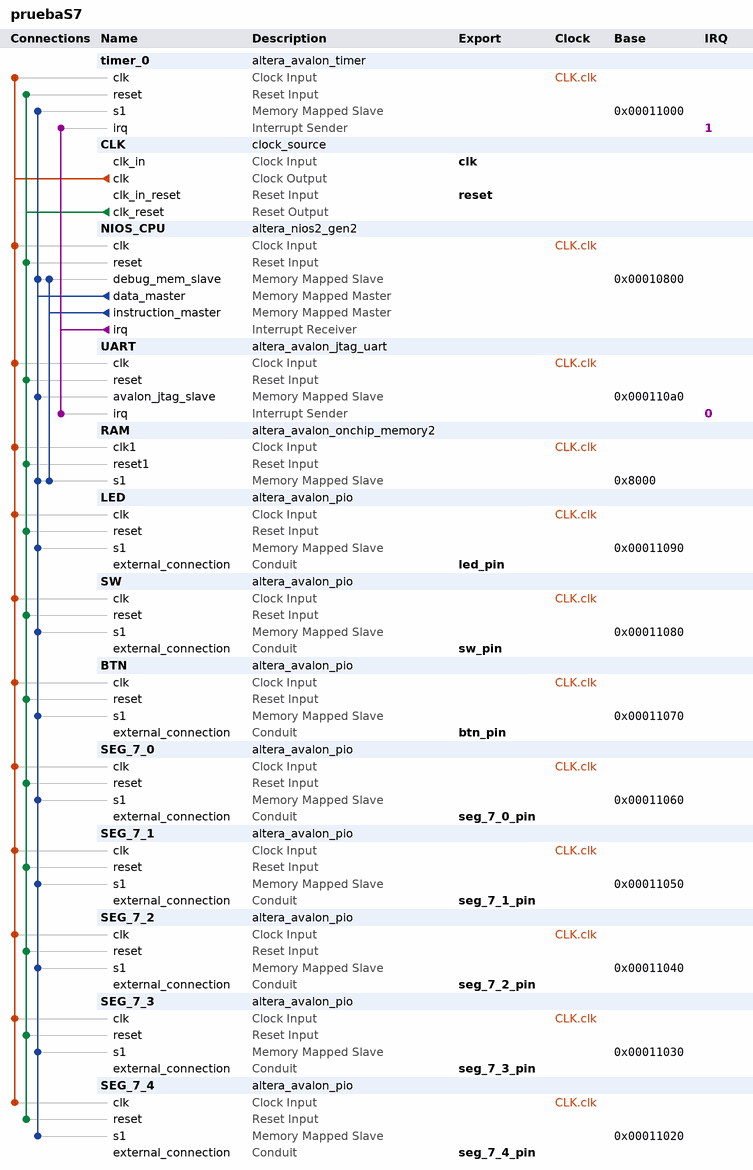
[diagram p0: system contents]
# Platform Designer (Qsys) system pruebaS7, Cyclone V 5CSEMA5F31C6
# Parameters at their usual value, and those the tool derives, are not listed.
package require -exact qsys 18.1
create_system pruebaS7
set_project_property DEVICE_FAMILY {Cyclone V}
set_project_property DEVICE 5CSEMA5F31C6

add_instance timer_0 altera_avalon_timer 18.1
set_instance_parameter_value timer_0 alwaysRun true
set_instance_parameter_value timer_0 fixedPeriod true
set_instance_parameter_value timer_0 period 1
set_instance_parameter_value timer_0 periodUnits SEC
set_instance_parameter_value timer_0 snapshot false

add_instance CLK clock_source 18.1
set_instance_parameter_value CLK clockFrequency 50000000

add_instance NIOS_CPU altera_nios2_gen2 18.1
set_instance_parameter_value NIOS_CPU dcache_size 2048
set_instance_parameter_value NIOS_CPU exceptionSlave RAM.s1
set_instance_parameter_value NIOS_CPU icache_size 4096
set_instance_parameter_value NIOS_CPU impl Tiny
set_instance_parameter_value NIOS_CPU resetSlave RAM.s1

add_instance UART altera_avalon_jtag_uart 18.1
set_instance_parameter_value UART simInteractiveOptions NO_INTERACTIVE_WINDOWS

add_instance RAM altera_avalon_onchip_memory2 18.1
set_instance_parameter_value RAM dataWidth 32
set_instance_parameter_value RAM dualPort false
set_instance_parameter_value RAM initMemContent true
set_instance_parameter_value RAM initializationFileName onchip_mem.hex
set_instance_parameter_value RAM memorySize 32768

add_instance LED altera_avalon_pio 18.1
set_instance_parameter_value LED direction Output
set_instance_parameter_value LED width 8

add_instance SW altera_avalon_pio 18.1
set_instance_parameter_value SW direction Input
set_instance_parameter_value SW width 8

add_instance BTN altera_avalon_pio 18.1
set_instance_parameter_value BTN direction Input
set_instance_parameter_value BTN width 2

add_instance SEG_7_0 altera_avalon_pio 18.1
set_instance_parameter_value SEG_7_0 direction Output
set_instance_parameter_value SEG_7_0 width 7

add_instance SEG_7_1 altera_avalon_pio 18.1
set_instance_parameter_value SEG_7_1 direction Output
set_instance_parameter_value SEG_7_1 width 7

add_instance SEG_7_2 altera_avalon_pio 18.1
set_instance_parameter_value SEG_7_2 direction Output
set_instance_parameter_value SEG_7_2 width 7

add_instance SEG_7_3 altera_avalon_pio 18.1
set_instance_parameter_value SEG_7_3 direction Output
set_instance_parameter_value SEG_7_3 width 7

add_instance SEG_7_4 altera_avalon_pio 18.1
set_instance_parameter_value SEG_7_4 direction Output
set_instance_parameter_value SEG_7_4 width 7

# connections
add_connection CLK.clk BTN.clk clock
add_connection CLK.clk LED.clk clock
add_connection CLK.clk NIOS_CPU.clk clock
add_connection CLK.clk RAM.clk1 clock
add_connection CLK.clk SEG_7_0.clk clock
add_connection CLK.clk SEG_7_1.clk clock
add_connection CLK.clk SEG_7_2.clk clock
add_connection CLK.clk SEG_7_3.clk clock
add_connection CLK.clk SEG_7_4.clk clock
add_connection CLK.clk SW.clk clock
add_connection CLK.clk timer_0.clk clock
add_connection CLK.clk UART.clk clock
add_connection CLK.clk_reset BTN.reset reset
add_connection CLK.clk_reset LED.reset reset
add_connection CLK.clk_reset NIOS_CPU.reset reset
add_connection CLK.clk_reset RAM.reset1 reset
add_connection CLK.clk_reset SEG_7_0.reset reset
add_connection CLK.clk_reset SEG_7_1.reset reset
add_connection CLK.clk_reset SEG_7_2.reset reset
add_connection CLK.clk_reset SEG_7_3.reset reset
add_connection CLK.clk_reset SEG_7_4.reset reset
add_connection CLK.clk_reset SW.reset reset
add_connection CLK.clk_reset timer_0.reset reset
add_connection CLK.clk_reset UART.reset reset
add_connection NIOS_CPU.data_master BTN.s1 avalon
set_connection_parameter_value NIOS_CPU.data_master/BTN.s1 baseAddress 0x00011070
add_connection NIOS_CPU.data_master LED.s1 avalon
set_connection_parameter_value NIOS_CPU.data_master/LED.s1 baseAddress 0x00011090
add_connection NIOS_CPU.data_master NIOS_CPU.debug_mem_slave avalon
set_connection_parameter_value NIOS_CPU.data_master/NIOS_CPU.debug_mem_slave baseAddress 0x00010800
add_connection NIOS_CPU.data_master RAM.s1 avalon
set_connection_parameter_value NIOS_CPU.data_master/RAM.s1 baseAddress 0x8000
add_connection NIOS_CPU.data_master SEG_7_0.s1 avalon
set_connection_parameter_value NIOS_CPU.data_master/SEG_7_0.s1 baseAddress 0x00011060
add_connection NIOS_CPU.data_master SEG_7_1.s1 avalon
set_connection_parameter_value NIOS_CPU.data_master/SEG_7_1.s1 baseAddress 0x00011050
add_connection NIOS_CPU.data_master SEG_7_2.s1 avalon
set_connection_parameter_value NIOS_CPU.data_master/SEG_7_2.s1 baseAddress 0x00011040
add_connection NIOS_CPU.data_master SEG_7_3.s1 avalon
set_connection_parameter_value NIOS_CPU.data_master/SEG_7_3.s1 baseAddress 0x00011030
add_connection NIOS_CPU.data_master SEG_7_4.s1 avalon
set_connection_parameter_value NIOS_CPU.data_master/SEG_7_4.s1 baseAddress 0x00011020
add_connection NIOS_CPU.data_master SW.s1 avalon
set_connection_parameter_value NIOS_CPU.data_master/SW.s1 baseAddress 0x00011080
add_connection NIOS_CPU.data_master timer_0.s1 avalon
set_connection_parameter_value NIOS_CPU.data_master/timer_0.s1 baseAddress 0x00011000
add_connection NIOS_CPU.data_master UART.avalon_jtag_slave avalon
set_connection_parameter_value NIOS_CPU.data_master/UART.avalon_jtag_slave baseAddress 0x000110a0
add_connection NIOS_CPU.instruction_master NIOS_CPU.debug_mem_slave avalon
set_connection_parameter_value NIOS_CPU.instruction_master/NIOS_CPU.debug_mem_slave baseAddress 0x00010800
add_connection NIOS_CPU.instruction_master RAM.s1 avalon
set_connection_parameter_value NIOS_CPU.instruction_master/RAM.s1 baseAddress 0x8000
add_connection NIOS_CPU.irq timer_0.irq interrupt
set_connection_parameter_value NIOS_CPU.irq/timer_0.irq irqNumber 1
add_connection NIOS_CPU.irq UART.irq interrupt
set_connection_parameter_value NIOS_CPU.irq/UART.irq irqNumber 0

# exported interfaces
add_interface btn_pin conduit end
set_interface_property btn_pin EXPORT_OF BTN.external_connection
add_interface clk clock sink
set_interface_property clk EXPORT_OF CLK.clk_in
add_interface led_pin conduit end
set_interface_property led_pin EXPORT_OF LED.external_connection
add_interface reset reset sink
set_interface_property reset EXPORT_OF CLK.clk_in_reset
add_interface seg_7_0_pin conduit end
set_interface_property seg_7_0_pin EXPORT_OF SEG_7_0.external_connection
add_interface seg_7_1_pin conduit end
set_interface_property seg_7_1_pin EXPORT_OF SEG_7_1.external_connection
add_interface seg_7_2_pin conduit end
set_interface_property seg_7_2_pin EXPORT_OF SEG_7_2.external_connection
add_interface seg_7_3_pin conduit end
set_interface_property seg_7_3_pin EXPORT_OF SEG_7_3.external_connection
add_interface seg_7_4_pin conduit end
set_interface_property seg_7_4_pin EXPORT_OF SEG_7_4.external_connection
add_interface sw_pin conduit end
set_interface_property sw_pin EXPORT_OF SW.external_connection

set_interconnect_requirement {$system} qsys_mm.clockCrossingAdapter HANDSHAKE
set_interconnect_requirement {$system} qsys_mm.enableEccProtection FALSE
set_interconnect_requirement {$system} qsys_mm.insertDefaultSlave FALSE
set_interconnect_requirement {$system} qsys_mm.maxAdditionalLatency 1

save_system pruebaS7.qsys
